# EAGLE design Skiff Power (EAGLE 9.6.2)
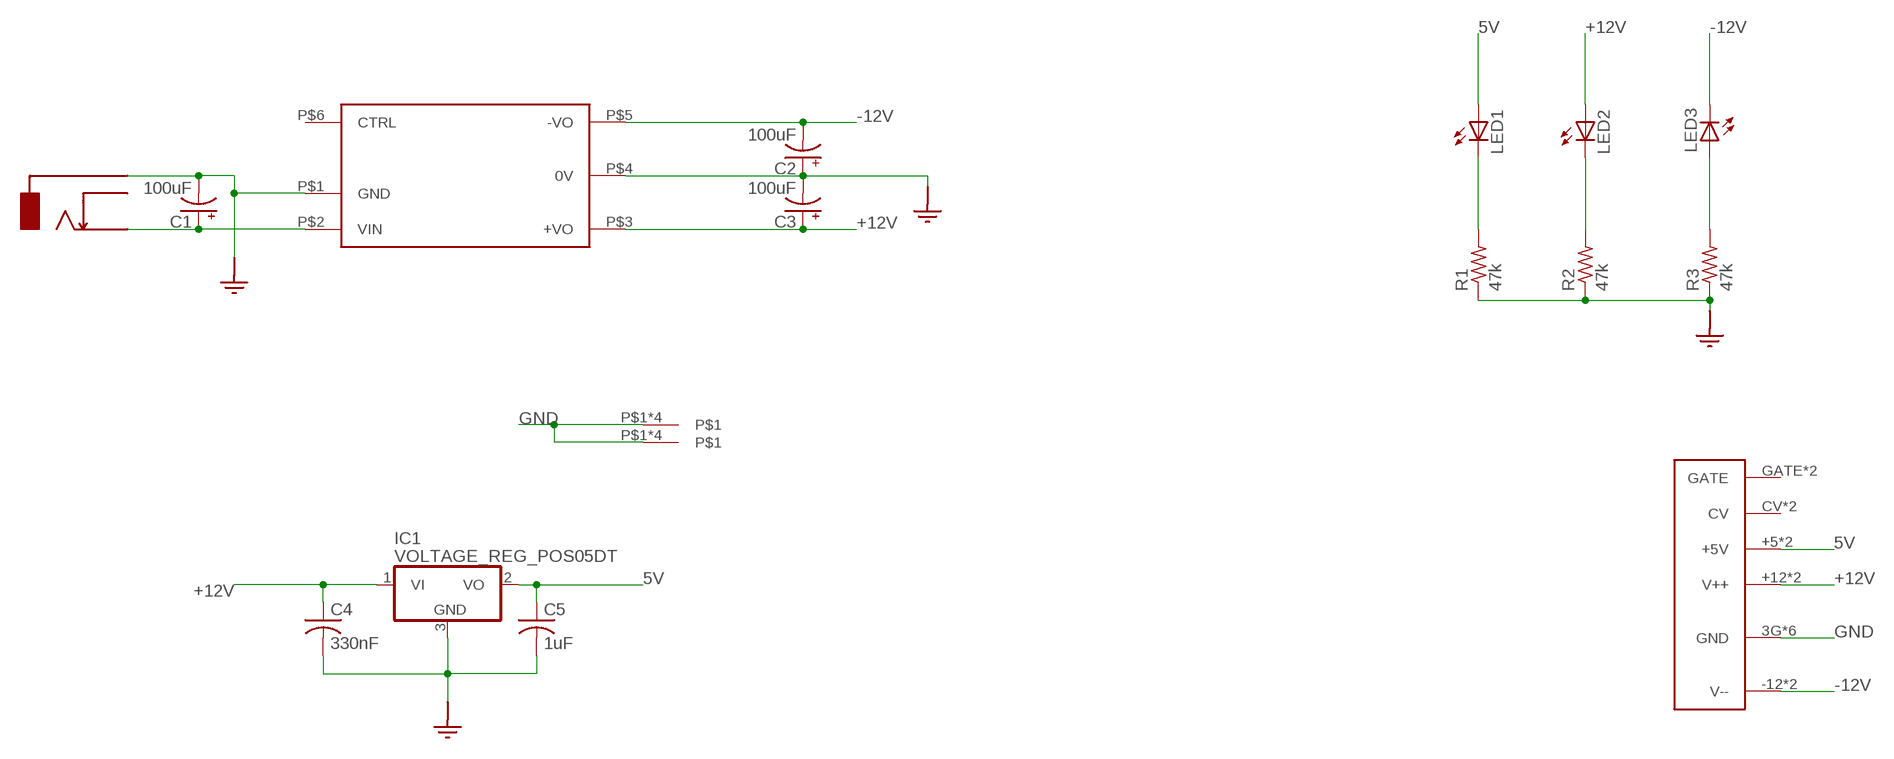
[diagram p0: schematic, sheet 1]

## Parts
C1  100uF  CPOL-USSANYO_D  [SANYO-OSCON_D]
C2  100uF  CPOL-USSANYO_D  [SANYO-OSCON_D]
C3  100uF  CPOL-USSANYO_D  [SANYO-OSCON_D]
C4  330nF  CAPACITOR-USC0805  [C0805]
C5  1uF  CAPACITOR-USC0805  [C0805]
IC1  VOLTAGE_REG_POS05DT  [TO252]
LED1  LED3MM  [LED3MM]
LED2  LED3MM  [LED3MM]
LED3  LED3MM  [LED3MM]
R1  47k  RESISTOR_USR0805  [R0805]
R2  47k  RESISTOR_USR0805  [R0805]
R3  47k  RESISTOR_USR0805  [R0805]
U$1  URA241XLD-20WR3  [URA241XLD-20WR3]
U$2  SOCKET_DC_POWER  [DC-POWER]
U$3  EURO_POWER_16  [POWER_SHROUDED]
U$10  PCBMOUNT  [PCB-2-MOUNTING]
U$11  PCBMOUNT  [PCB-2-MOUNTING]

## Nets
5V: C5.1 IC1.2(VO) LED1.A U$3.+5(+5V) U$3.+5A(+5V)
+12V: C3.+ C4.1 IC1.1(VI) LED2.A U$1.P$3(+VO) U$3.+12(V++) U$3.+12A(V++)
-12V: C2.- LED3.K(C) U$1.P$5(-VO) U$3.-12(V--) U$3.-12A(V--)
GND: C1.- C2.+ C3.- C4.2 C5.2 IC1.3(GND) R1.1 R2.1 R3.1 U$1.P$1(GND) U$1.P$4(0V) U$2.SLEEVEBOT(SLEEVE) U$2.SLEEVETOP(SLEEVE) U$3.3G(GND) U$3.4G(GND) U$3.5G(GND) U$3.6G(GND) U$3.7G(GND) U$3.8G(GND) U$10.P$1 U$10.P$2 U$10.P$3 U$10.P$4 U$11.P$1 U$11.P$2 U$11.P$3 U$11.P$4
N$1: LED1.K(C) R1.2
N$2: C1.+ U$1.P$2(VIN) U$2.PINBOT(PIN) U$2.PINTOP(PIN)
N$3: LED2.K(C) R2.2
N$4: LED3.A R3.2
Unconnected: U$1.P$6(CTRL) U$2.SWITCHBOT(SWITCH) U$2.SWITCHTOP(SWITCH) U$3.CV U$3.CVA(CV) U$3.GATE U$3.GATEA(GATE)

## Library data of the parts
C1-C3 = GMSN:CPOL-US: POLARIZED CAPACITOR, American symbol
C4 C5 = GMSN:CAPACITOR-US: Capacitor; SORT: 3
IC1 = GMSN:VOLTAGE_REG_POS: Positive Voltage Regulator Added bigger pads to the TO-92 package; SORT: 4
LED1-LED3 = GMSN:LED: LED OSRAM: - CHIPLED LG R971, LG N971, LY N971, LG Q971, LY Q971, LO R971, LY R971 LH N974, LH R974 LS Q976, LO Q976, LY Q976 LO Q996 - Hyper CHIPLED LW Q18S LB Q993, LB Q99A, LB R99A - SideLED LS A670, LO A670, LY A670, LG A670, LP A670 LB A673, LV A673, LT A673, LW A673 LH A674 LY A675 LS A676, LA A676, LO A676, LY A676, LW A676 LS A679, LY A679, LG A679 - Hyper Micro SIDELED® LS Y876, LA Y876, LO Y876, LY Y876 LT Y87S - SmartLED LW L88C, LW L88S LB L89C, LB L89S, LG L890 LS L89K, LO L89K, LY L89K LS L896, LA L896, LO L896, LY L896 - TOPLED LS T670, LO T670, LY T670, LG T670, LP T670 LSG T670, LSP T670, LSY T670, LOP T670, LYG T670 LG T671, LOG T671, LSG T671 LB T673, LV T673, LT T673, LW T673 LH T674 LS T676, LA T676, LO T676, LY T676, LB T676, LH T676, LSB T676, LW T676 LB T67C, LV T67C, LT T67C, LS T67K, LO T67K, LY T67K, LW E67C LS E67B, LA E67B, LO E67B, LY E67B, LB E67C, LV E67C, LT E67C LW T67C LS T679, LY T679, LG T679 LS T770, LO T770, LY T770, LG T770, LP T770 LB T773, LV T773, LT T773, LW T773 LH T774 LS E675, LA E675, LY E675, LS T675 LS T776, LA T776, LO T776, LY T776, LB T776 LHGB T686 LT T68C, LB T68C - Hyper Mini TOPLED® LB M676 - Mini TOPLED Santana® LG M470 LS M47K, LO M47K, LY M47K Source: http://www.osram.convergy.de/
R1-R3 = GMSN:RESISTOR_US: Resistor; SORT: 2
U$1 = GMSN:URA241XLD-20WR3
U$2 = GMSN:SOCKET_DC_POWER: DC Power Socket; SORT: 9
U$3 = GMSN:EURO_POWER_16
U$10 U$11 = GMSN:PCBMOUNT

## Board
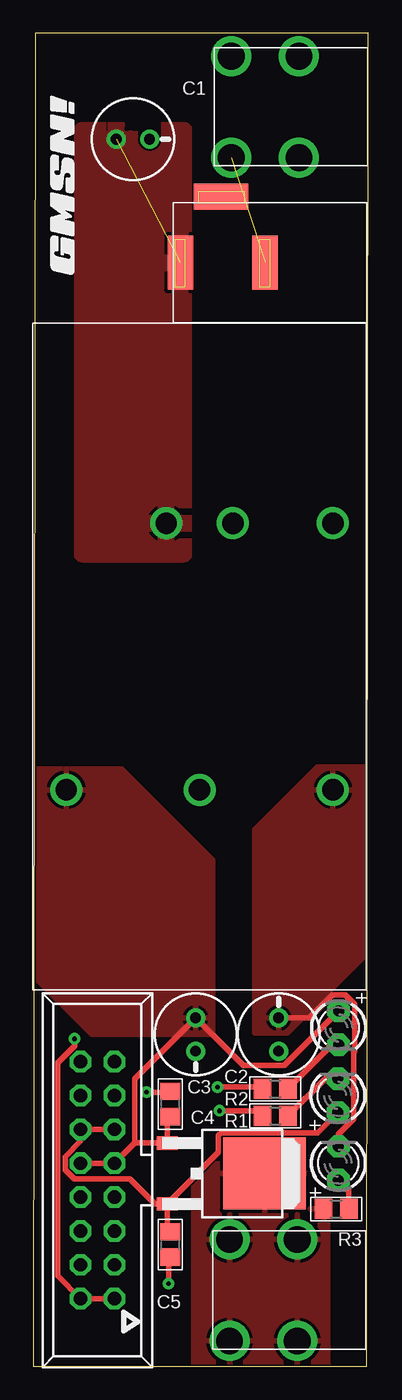
[diagram p1: board, top side]
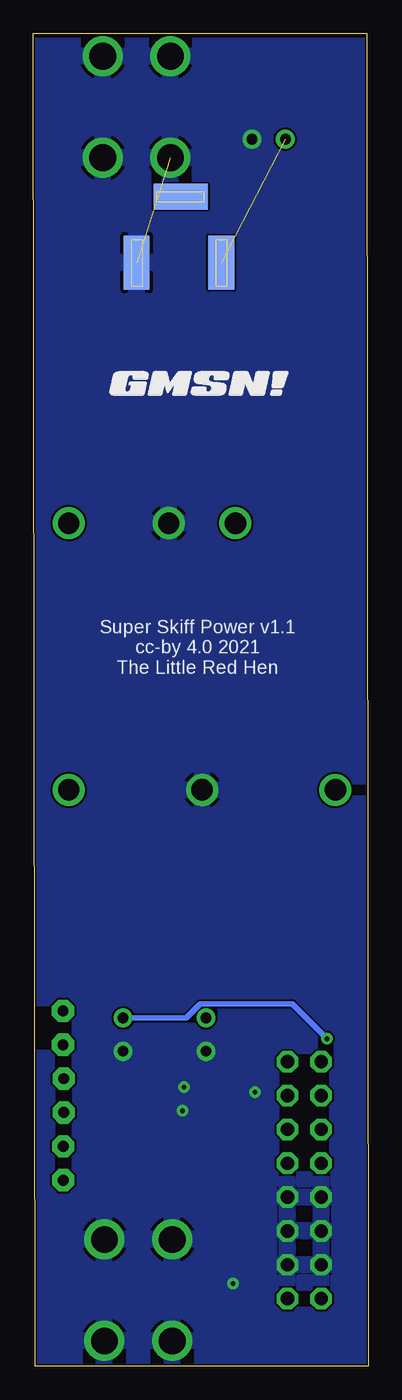
[diagram p2: board, bottom side, seen from below]

Size 25.13 x 100 mm. Coordinates in mm from the lower left corner, seen from the top.
Outline: 0.13,100 0,0 25,0 25.13,100 0.13,100
Copper layers (1*16): Top 0.035mm / dielectric 1.5mm / Bottom 0.035mm
Design rules "PCBWay": minimum track width 6mil, minimum drill 12mil, track to track 6mil, track to pad 6mil, pad to pad 6mil, via to via 6mil, smd to smd 6mil, copper to edge 6mil, drill to drill 6mil, minimum pad ring 12mil, minimum via ring 10mil, stop-mask expansion 4mil, vias tented up to drill 25mil, thermal gap 10mil

### Footprints (pad centres in the part's own frame; a part is rotated, then mirrored left to right if it is on the bottom)
SANYO-OSCON_D = drill 0.8 pad 1.27: + 1.25,0; - -1.25,0
C0805 = smd 1.3 x 1.5: 1 -0.95,0; 2 0.95,0
TO252 = smd 1 x 1.6: 1 -2.28,-4.8; 2 2.28,-4.8 | smd 5.4 x 6.2: 3 0,2.5
LED3MM = drill 0.813 pad 1.676 octagon: A -1.27,0; K 1.27,0
R0805 = smd 1.3 x 1.5: 1 -0.95,0; 2 0.95,0
URA241XLD-20WR3 = drill 1.6: P$1 -15,0; P$2 -15,-5; P$3 5,-12.5; P$4 5,-2.5; P$5 5,7.5; P$6 -15,7.5
DC-POWER = smd 4.064 x 1.93 bottom: PINBOT 0,13.97; SLEEVEBOT 0,7.62 | smd 4.064 x 1.93: PINTOP 0,13.97; SLEEVETOP 0,7.62 | smd 1.93 x 4.064 bottom: SWITCHBOT 4.953,10.922 | smd 1.93 x 4.064: SWITCHTOP 4.953,10.922
POWER_SHROUDED = drill 1 octagon: 3G -6.35,-1.27; 4G -6.35,1.27; 5G -3.81,-1.27; 6G -3.81,1.27; 7G -1.27,-1.27; 8G -1.27,1.27; +5 3.81,-1.27; +5A 3.81,1.27; +12 1.27,-1.27; +12A 1.27,1.27; -12 -8.89,-1.27; -12A -8.89,1.27; CV 6.35,-1.27; CVA 6.35,1.27; GATE 8.89,-1.27; GATEA 8.89,1.27
PCB-2-MOUNTING = drill 2: P$1 -10.16,3.81; P$2 -5.08,3.81; P$3 -5.08,-3.81; P$4 -10.16,-3.81

### Placement (x,y rotation side)
C1  7.47,92.06 180 top
C2  18.4,24.88 270 top
C3  12.17,24.88 90 top
C4  10.27,19.67 90 top
C5  10.27,9.13 270 top
IC1  14.84,14.46 270 top
LED1  22.84,20.3 90 top
LED2  22.9,25.39 270 top
LED3  22.88,15.22 90 top
R1  18.14,18.78 0 top
R2  18.14,20.81 0 top
R3  22.71,11.8 0 top
U$1  14.97,48.25 270 top
U$2  25,82.79 90 top
U$3  4.81,13.96 90 top
U$4  [GMSN!_LOGO]  2.27,88.88 90 top
U$5  [GMSN!_LOGO]  12.43,73.64 0 bottom
U$10  24.87,5.7 0 top
U$11  25,94.47 0 top

### Tracks (layer width: path | path; a pad name or v marks a point on that pad's centre or on a via)
5V
  Top 0.406: U$3.+5 U$3.+5A 3.54,16.87 2.38,15.71 2.38,14.74 3.06,14.06 7.24,14.06 9.12,12.18 IC1.2 | C5.1 10.04,10.31 IC1.2 | LED1.A 21.32,17.52 14.09,17.52 13.88,17.31 13.88,16.03 IC1.2
+12V
  Top 0.406: U$3.+12A U$3.+12 7.6,16.74 | C4.1 10.04,18.49 IC1.1 7.6,16.74 | LED2.A 19.46,23.21 19.46,23.19 18.84,22.57 15.73,22.57 C3.+ 7.6,21.55 7.6,16.74
  pour Top: 13.44,24.88 13.44,37.96 6.58,44.82 -0.02,44.82 -0.02,29.32 4.43,24.88
-12V  (via drill 0.35)
  Top 0.406: U$3.-12 U$3.-12A 1.82,6.78 1.82,22.77 3.09,24.04 v3.09,24.56 | LED3.K 22.88,17.38 24.04,18.54 24.04,23.56 24.09,23.62 24.09,27.15 23.39,27.85 22.4,27.85 20.68,26.13 C2.-
  Bottom 0.406: C2.- 13.67,26.13 12.61,27.19 5.72,27.19 v3.09,24.56
  pour Top: 25,44.94 21.32,44.94 16.62,40.24 16.62,25 19.03,25 25,30.97
GND  (via drill 0.35)  (2 unrouted)
  Top 0.406: v10.14,6.21 10.14,8.05 C5.2 | v8.49,20.56 10.21,20.56 C4.2 | v13.82,20.94 17.07,20.94 R2.1 | v13.95,19.16 16.81,19.16 R1.1
  pour Bottom: 25.25,99.05 25.25,-1.29 -0.15,-1.29 -0.15,99.05
  pour Top: 21.95,-0.01 12.05,-0.01 12.05,14.84 14.21,17 20.3,17 20.3,12.69 22.08,10.91 22.08,-0.01
N$1
  Top 0.406: R1.2 21.89,21.58 LED1.K
N$2  (2 unrouted)
  pour Top: 3.66,60.95 11.28,60.95 11.28,92.69 3.66,92.69
N$3
  Top 0.406: R2.2 22.39,24.12 LED2.K
N$4
  Top 0.406: LED3.A 23.66,13.17 R3.2

### Text on the board
bNames: Super Skiff Power v1.1 / cc-by 4.0 2021 / The Little Red Hen